# Altium schematic sheet 300_MCU.SchDoc: MCU
size A4; Organization: Altium Limited; Address1: L3, 12a Rodborough Rd; Address2: Frenchs Forest; Address3: NSW; Address4: Australia 2086; DocumentNumber: 5; SheetNumber: 5; SheetTotal: 6
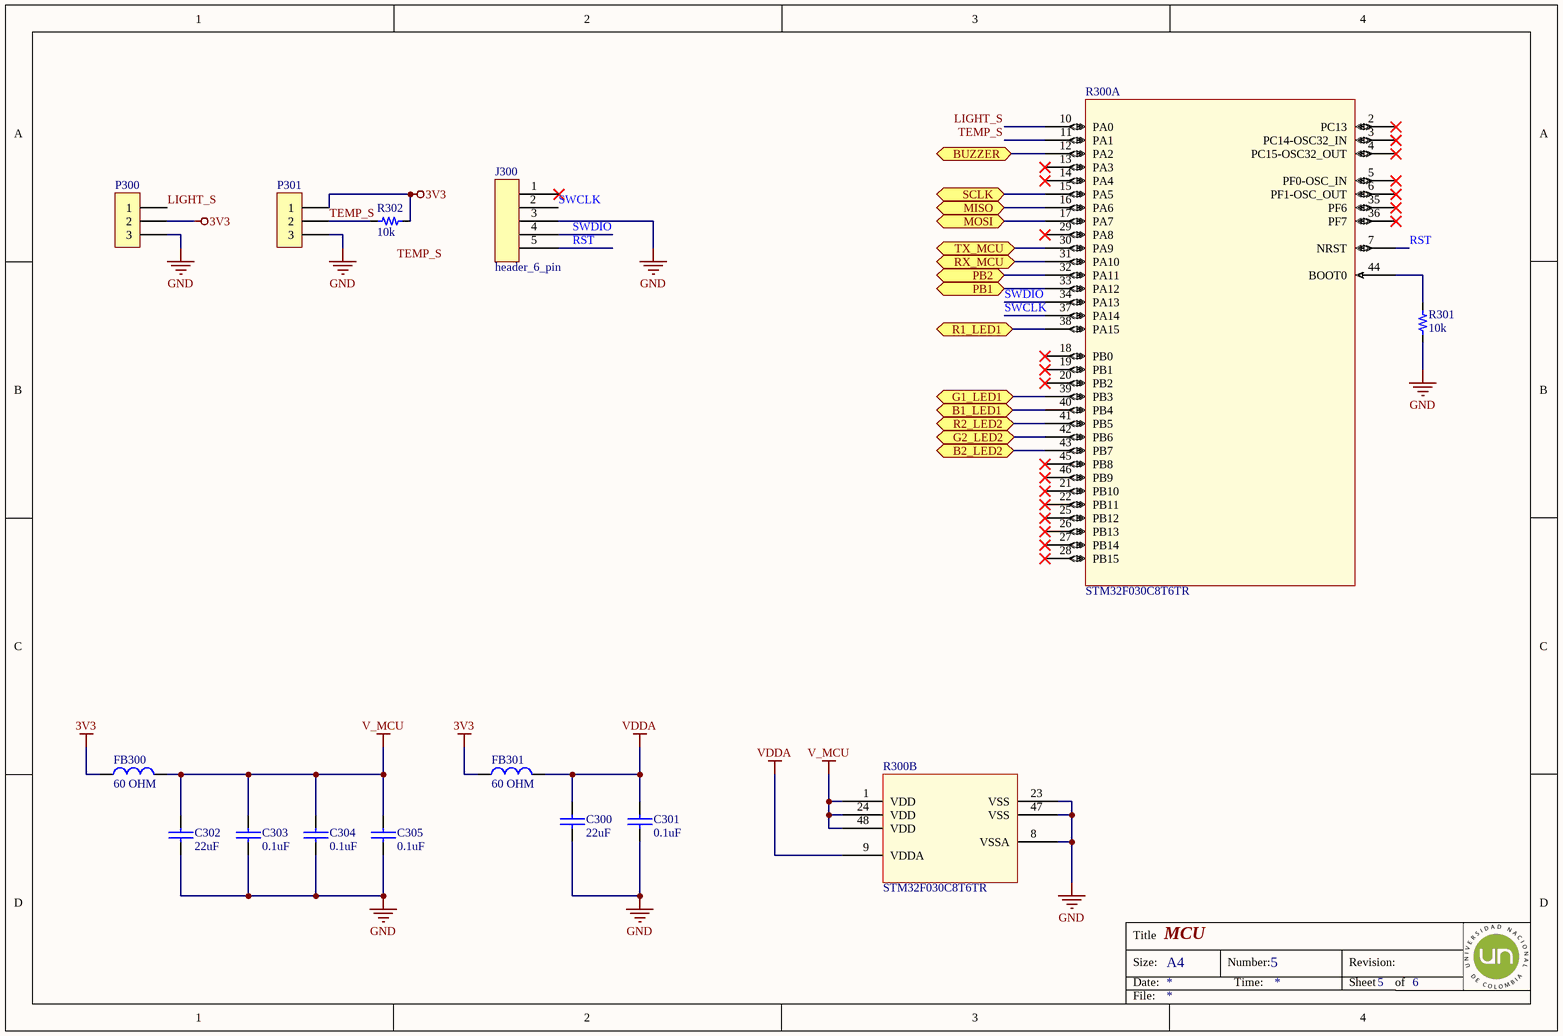
[diagram p0: 300_MCU.SchDoc]

## Parts
C300  value 22uF  [0603_cap]  (hidden comment: 22uF 6V3)
C301  value 0.1uF  [0603_cap]  (hidden comment: 0.1uF 50V)
C302  value 22uF  [0603_cap]  (hidden comment: 22uF 6V3)
C303  value 0.1uF  [0603_cap]  (hidden comment: 0.1uF 50V)
C304  value 0.1uF  [0603_cap]  (hidden comment: 0.1uF 50V)
C305  value 0.1uF  [0603_cap]  (hidden comment: 0.1uF 50V)
FB300  value 60 OHM  [0603_fb]  (hidden comment: 60OHM 2A)
FB301  value 60 OHM  [0603_fb]  (hidden comment: 60OHM 2A)
J300  header_6_pin  [header_6_pin]
P300  HEAD_FEMALE_3  [HEAD_FEMALE_3]  (value not drawn)
P301  HEAD_FEMALE_3  [HEAD_FEMALE_3]  (value not drawn)
R300  STM32F030C8T6TR  [LQFP48_7x7mm]  (parts A,B of 2)
R301  value 10k  [0603_res]  (hidden comment: 10k 1/10W)
R302  value 10k  [0603_res]  (hidden comment: 10k 1/10W)

## Ports
B1_LED1 (bidir, see MAIN[2C], 100_H&M_interface[3C]), B2_LED2 (bidir, see MAIN[2C], 100_H&M_interface[3C]), BUZZER (bidir, see MAIN[2C], 100_H&M_interface[1C]), G1_LED1 (bidir, see MAIN[2C], 100_H&M_interface[3B]), G2_LED2 (bidir, see MAIN[2C], 100_H&M_interface[3B]), MISO (bidir, see MAIN[3C], 400_FLAHS_MEMORY[2B]), MOSI (bidir, see MAIN[3C], 400_FLAHS_MEMORY[3C]), PB1 (bidir, see MAIN[3C], 100_H&M_interface[1A]), PB2 (bidir, see MAIN[3C], 100_H&M_interface[1A]), R1_LED1 (bidir, see MAIN[2C], 100_H&M_interface[3A]), R2_LED2 (bidir, see MAIN[2C], 100_H&M_interface[3A]), RX_MCU (bidir, see MAIN[3B], 200_UART_TO_USB[3C]), SCLK (bidir, see MAIN[3C], 400_FLAHS_MEMORY[3B]), TX_MCU (bidir, see MAIN[3B], 200_UART_TO_USB[3C])

## Nets
3V3: FB300.1 FB301.1 P300.2 P301.1 R302.2
GND: C300.2 C301.2 C302.2 C303.2 C304.2 C305.2 J300.3 P300.3 P301.3 R300.8(VSSA) R300.23(VSS) R300.47(VSS) R301.1
V_MCU: C302.1 C303.1 C304.1 C305.1 FB300.2 R300.1(VDD) R300.24(VDD) R300.48(VDD)
VDDA: C300.1 C301.1 FB301.2 R300.9(VDDA)
B1_LED1: R300.40(PB4) ; port B1_LED1
B2_LED2: R300.43(PB7) ; port B2_LED2
BUZZER: R300.12(PA2) ; port BUZZER
G1_LED1: R300.39(PB3) ; port G1_LED1
G2_LED2: R300.42(PB6) ; port G2_LED2
LIGHT_S: P300.1 R300.10(PA0)
MISO: R300.16(PA6) ; port MISO
MOSI: R300.17(PA7) ; port MOSI
PB1: R300.33(PA12) ; port PB1
PB2: R300.32(PA11) ; port PB2
R1_LED1: R300.38(PA15) ; port R1_LED1
R2_LED2: R300.41(PB5) ; port R2_LED2
RST: J300.5 R300.7(NRST)
RX_MCU: R300.31(PA10) ; port RX_MCU
SCLK: R300.15(PA5) ; port SCLK
SWCLK: J300.2 R300.37(PA14)
SWDIO: J300.4 R300.34(PA13)
TEMP_S: P301.2 R300.11(PA1) R302.1
TX_MCU: R300.30(PA9) ; port TX_MCU
NetR300_44: R300.44(BOOT0) R301.2

Not connected (* = marked no-connect by the designer): J300 1(5)*; R300 2(PC13)* 3(PC14-OSC32_IN)* 4(PC15-OSC32_OUT)* 5(PF0-OSC_IN)* 6(PF1-OSC_OUT)* 13(PA3)* 14(PA4)* 18(PB0)* 19(PB1)* 20(PB2)* 21(PB10)* 22(PB11)* 25(PB12)* 26(PB13)* 27(PB14)* 28(PB15)* 29(PA8)* 35(PF6)* 36(PF7)* 45(PB8)* 46(PB9)*

## Notes on the sheet
- Labels drawn without touching a wire or pin: TEMP_S
- Title
- Size:
- Date:
- A4
- Number:
- Time:
- Revision:
- Sheet
- of
- File:

## Library data of the parts
C300 C302 = Cap_22uF_0805_6V3: 6.3V 22uF X5R ±20% 0805 Multilayer Ceramic Capacitors MLCC - SMD/SMT ROHS; Manufacturer: Samsung Electro-Mechanics; Manufacturer Part Number: CL21A226MQQNNNE; Supplier 1: LCSC; Supplier Part Number 1: C5674; ComponentLink1Description: LCSC; ComponentLink1URL: https://www.lcsc.com/product-detail/Multilayer-Ceramic-Capacitors-MLCC-SMD-SMT_Samsung-Electro-Mechanics-CL21A226MQQNNNE_C5674.html
C301 C303-C305 = Cap_0.1uF_0603_50V: 50V 100nF Y5V -20%~+80% 0603 Multilayer Ceramic Capacitors MLCC - SMD/SMT ROHS; Manufacturer: Walsin Tech Corp; Manufacturer Part Number: 0603F104Z500CT; Supplier 1: LCSC; Supplier Part Number 1: C83060; ComponentLink1Description: LCSC; ComponentLink1URL: https://www.lcsc.com/product-detail/Multilayer-Ceramic-Capacitors-MLCC-SMD-SMT_Walsin-Tech-Corp-0603F104Z500CT_C83060.html
FB300 FB301 = FB_60_0603_2A: 2A 1 100mΩ 60Ω@100MHz ±25% 0603 Ferrite Beads ROHS; Manufacturer: TAI-TECH; Manufacturer Part Number: HCB1608KF-600T20; ComponentLink1Description: LCSC; ComponentLink1URL: https://www.lcsc.com/product-detail/Ferrite-Beads_TAI-TECH-HCB1608KF-600T20_C369516.html; Supplier 1: LCSC; Supplier Part Number 1: C369516
J300 = header_6_pin: Straight Square Pins 2mm 3.9mm -40℃~+105℃ 2.8mm 5 2mm 单排 Black Brass 1x5P Plugin,P=2mm Pin Headers ROHS; Manufacturer: XFCN; Manufacturer part Number: PZ200V-11-05P; ComponentLink1Description: LCSC; ComponentLink1URL: https://www.lcsc.com/product-detail/span-style-background-color-ff0-Pin-span-span-style-background-color-ff0-Headers-span_XFCN-PZ200V-11-05P_C541859.html; Supplier: LCSC; Supplier Part Number: C541859; Usage: Straight
P300 P301 = HEAD_FEMALE_3: 2.54mm 单排 Gold Straight 1x3P 3 Plugin,P=2.54mm Female Headers ROHS; Manufacture: MINTRON; Manufacture Part Number: MTF185-103SY1; Supplier: LCSC; Usage: Straight; Supplier Part Number: C358717; ComponentLink1Description: datasheet; ComponentLink1URL: https://datasheet.lcsc.com/lcsc/1912111437_MINTRON-MTF185-103SY1_C358717.pdf
R300 = IC_STM32F030C8T6TR_LQFP48_7x7MM: IC MCU 32BIT 64KB FLASH 48LQFP; Manufacturer: STMicroelectronics; Manufacturer part number: STM32F030C8T6TR; Supplier 1: LCSC; Supplier Part Number 1: C23922; ComponentLink1Description: LCSC; ComponentLink1URL: https://www.lcsc.com/product-detail/ST-Microelectronics_STMicroelectronics-STM32F030C8T6_C23922.html
R301 R302 = Res_10k_0603_1/10W: RES SMD 10k OHM 5% 1/10W 0603; Manufacturer: FOJAN; Manufacturer Part Number: FRC0603J103TS; ComponentLink1URL: https://www.lcsc.com/product-detail/Chip-Resistor-Surface-Mount_FOJAN-FRC0603J103TS_C2930027.html; Supplier 1: LCSC; Supplier Part Number 1: C2930027; ComponentLink1Description: LCSC